# Altium schematic sheet Humi_Light_Pump.SchDoc
size A4
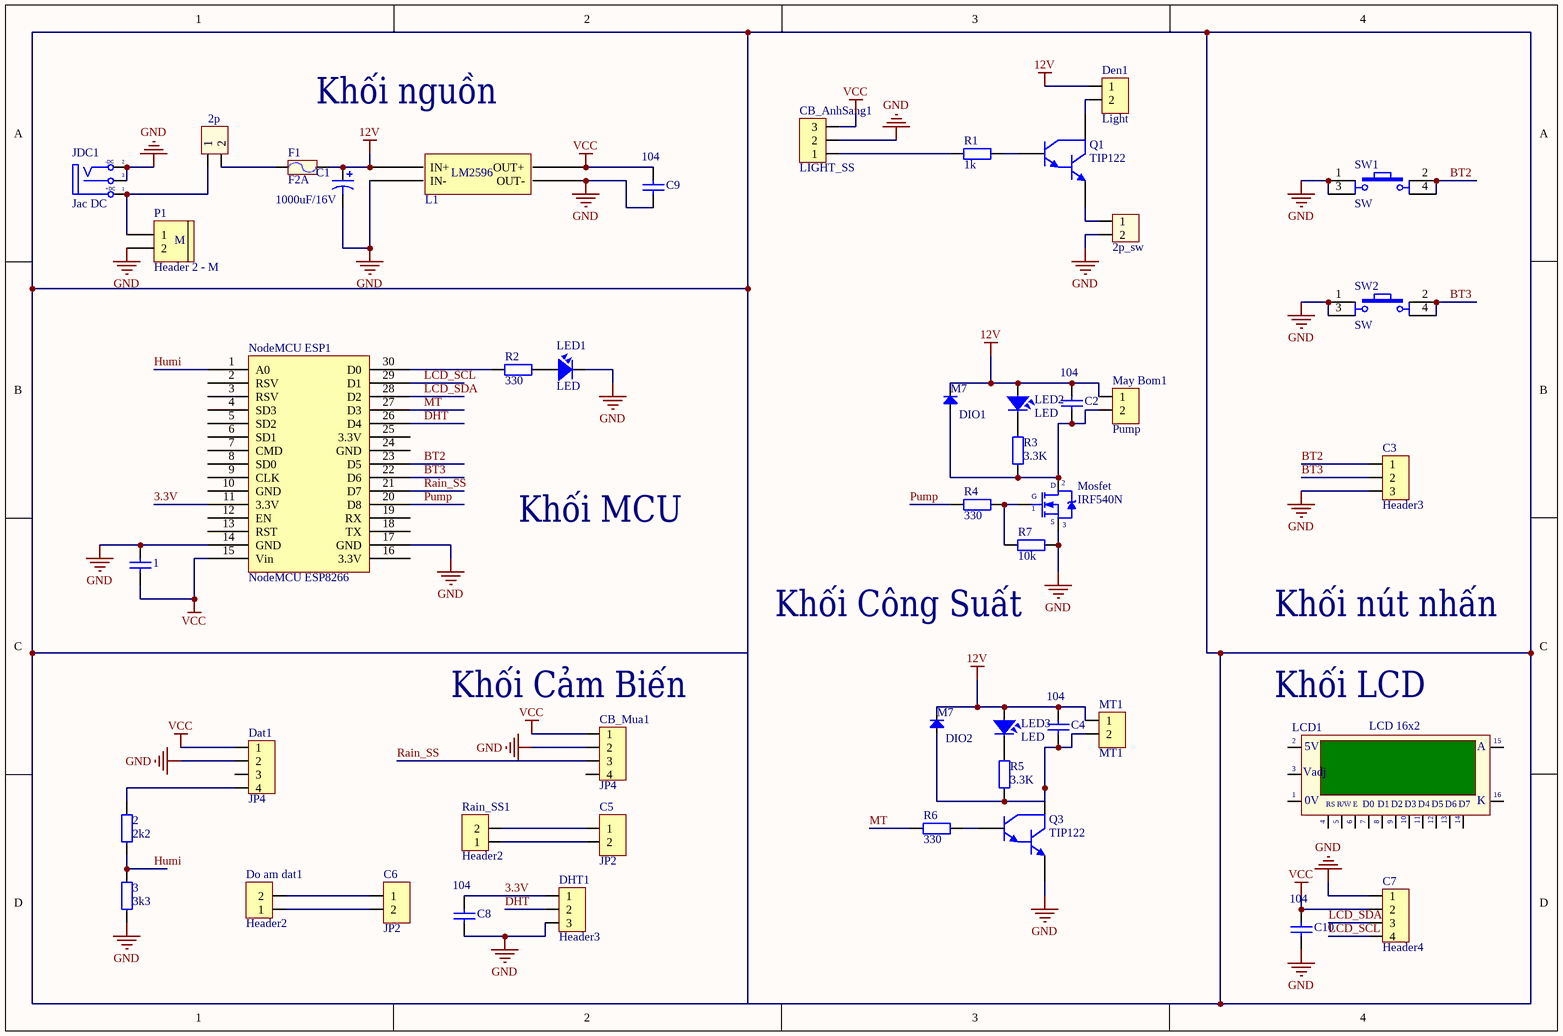
[diagram p0: Humi_Light_Pump.SchDoc]

## Parts
1  Capacitor Ceramic  [C1206]  (value not drawn)
2  2k2  [RES-SMD-1206]
3  3k3  [RES-SMD-1206]
C1  1000uF/16V  [C8mm]
C2  104  [C1206]
C3  Header3  [Header3]
C4  104  [C1206]
C5  JP2  [Header 2P DC 2.54]
C6  JP2  [Header 2P DC 2.54]
C7  Header4  [XH2.54M-4]
C8  104  [C1206]
C9  104  [C1206]
C10  104  [C1206]
CB_AnhSang1  LIGHT_SS  [Header 3P DC 2.54]
CB_Mua1  JP4  [JP4-C1T]
Dat1  JP4  [JP4-C1T]
Den1  Light  [Header 2P DC 2.54]
DHT1  Header3  [Header 3P DC 2.54]
DIO1  M7  [DIO-SMD-106]
DIO2  M7  [DIO-SMD-106]
Do_am_dat1  Header2  [Header2]
F1  F2A  [Fuse]
H1  2p  [XH2.54M-2]
H2  2p_sw  [XH2.54M-2]
JDC1  Jac DC  [DC-IN]
L1  BUCK_LM2596  [BUCK_LM2596]  (value not drawn)
LCD1  LCD 16x2  [LCD16X2N]
LED1  LED  [LED-5 GRe]
LED2  LED  [LED-5 GRe]
LED3  LED  [LED-5 GRe]
May_Bom1  Pump  [Header 2P DC 2.54]
Mosfet  IRF540N  [QTO-220]
MT1  MT1  [Header 2P DC 2.54]
NodeMCU_ESP1  NodeMCU ESP8266  [NodeMCU ESP8266]
P1  Header 2 - M  [Medium - Header 2]
Q1  TIP122  [QTO-220]
Q3  TIP122  [QTO-220]
R1  1k  [RES-SMD-1206]
R2  330  [RES-SMD-1206]
R3  3.3K  [RES-SMD-1206]
R4  330  [RES-SMD-1206]
R5  3.3K  [RES-SMD-1206]
R6  330  [RES-SMD-1206]
R7  10k  [RES-SMD-1206]
Rain_SS1  Header2  [Header2]
SW1  SW  [SW4]
SW2  SW  [SW4]

## Nets
12V: C1.1 C2.2 C4.2 Den1.1 DIO1.2(K) DIO2.2(K) F1.2 L1.1(IN+) LED2.1 LED3.1 May_Bom1.1 MT1.1
GND: 1.2 3.2 C1.2 C3.3 C7.1 C8.1 C9.1 C10.1 CB_AnhSang1.2 CB_Mua1.2 Dat1.2 DHT1.3 H2.2 JDC1.2(TN) JDC1.3(S) L1.2(IN-) L1.3(OUT-) LED1.2 Mosfet.3(S) NodeMCU_ESP1.14(GND) NodeMCU_ESP1.17(GND) P1.2 Q3.3(E) R7.1 SW1.1 SW1.3 SW2.1 SW2.3
VCC: 1.1 C7.2 C9.2 C10.2 CB_AnhSang1.3 CB_Mua1.1 Dat1.1 L1.4(OUT+) NodeMCU_ESP1.15(Vin)
3.3V: C8.2 DHT1.1 NodeMCU_ESP1.11(3.3V)
BT2: C3.1 NodeMCU_ESP1.23(D5) SW1.2 SW1.4
BT3: C3.2 NodeMCU_ESP1.22(D6) SW2.2 SW2.4
DHT: DHT1.2 NodeMCU_ESP1.26(D4)
Humi: 2.2 3.1 NodeMCU_ESP1.1(A0)
LCD_SCL: C7.4 NodeMCU_ESP1.29(D1)
LCD_SDA: C7.3 NodeMCU_ESP1.28(D2)
MT: NodeMCU_ESP1.27(D3) R6.2
Pump: NodeMCU_ESP1.20(D8) R4.2
Rain_SS: CB_Mua1.3 NodeMCU_ESP1.21(D7)
Net2_1: 2.1 Dat1.4
NetC2_1: C2.1 DIO1.1(A) May_Bom1.2 Mosfet.2(D) R3.2
NetC4_1: C4.1 DIO2.1(A) MT1.2 Q3.2(C) R5.2
NetC5_1: C5.1 Rain_SS1.2
NetC5_2: C5.2 Rain_SS1.1
NetC6_1: C6.1 Do_am_dat1.2
NetC6_2: C6.2 Do_am_dat1.1
NetCB_AnhSang1_1: CB_AnhSang1.1 R1.2
NetDen1_2: Den1.2 Q1.2(C)
NetF1_1: F1.1 H1.2
NetH1_1: H1.1 JDC1.1(T) P1.1
NetH2_1: H2.1 Q1.3(E)
NetLED1_1: LED1.1 R2.1
NetLED2_2: LED2.2 R3.1
NetLED3_2: LED3.2 R5.1
NetMosfet_1: Mosfet.1(G) R4.1 R7.2
NetNodeMCU_ESP1_30: NodeMCU_ESP1.30(D0) R2.2
NetQ1_1: Q1.1(B) R1.1
NetQ3_1: Q3.1(B) R6.1

Not connected (* = marked no-connect by the designer): CB_Mua1 4; Dat1 3; LCD1 1(GND) 2(VDD) 3(VAdj) 4(RS) 5(R/~{W}) 6(~{EN}) 7(D0) 8(D1) 9(D2) 10(D3) 11(D4) 12(D5) 13(D6) 14(D7) 15(A) 16(K); NodeMCU_ESP1 2(RSV) 3(RSV) 4(SD3) 5(SD2) 6(SD1) 7(CMD) 8(SD0) 9(CLK) 10(GND) 12(EN) 13(RST) 16(3.3V) 18(TX) 19(RX) 24(GND) 25(3.3V)

## Notes on the sheet
- Khối nguồn
- Khối MCU
- (near R7) Khối Công Suất
- Khối nút nhấn
- (near CB_Mua1) Khối Cảm Biến
- (near LCD1) Khối LCD
- (in symbol BUCK_LM2596) LM2596
- (in symbol DCIN) -DC; +DC
- (in symbol Header 2 - M) M
- (in symbol LCD) 5V; Vadj; |; 0V; R/W; E

## Library data of the parts
1 C2 C4 C8-C10 = CapSMD: Capacitor; Value: 33p; Published: 8-Jun-2000; LatestRevisionDate: 17-Jul-2002; LatestRevisionNote: Re-released for DXP Platform.; PackageReference: RAD-0.3; Publisher: Altium Limited
2 3 R1-R7 = R0805: Resistor SMD 0805; Published: 8-Jun-2000; LatestRevisionDate: 17-Jul-2002; LatestRevisionNote: Re-released for DXP Platform.; PackageReference: AXIAL-0.4; Publisher: Altium Limited
C1 = Cap Pol 12mm: Polarized Capacitor (Axial); Published: 8-Jun-2000; LatestRevisionDate: 17-Jul-2002; LatestRevisionNote: Re-released for DXP Platform.; PackageReference: POLAR0.8; Publisher: Altium Limited
C3 CB_AnhSang1 DHT1 = Header3: Header IDC, 3 x 1 Pin Vertical 2.54mm Pitch (Non-Boxed, Male); Manufacturer: W¨¹rth Elektronik eiSos GmbH; partNo: 613002143121; ComponentLink1 Description: Manufacturer; ComponentLink2 Description: Datasheet; NoPins: 02; Created Date: 29 March 2013; ComponentLink1URL: http://www.we-online.com; ComponentLink2URL: http://katalog.we-online.de/em/datasheet/6130xx143121.pdf; Created by: Karrer Zheng
C5 C6 = JP2: WR-PHD 2.54 mm Angled Socket Header; Manufacturer: W¨¹rth Elektronik eiSos GmbH; partNo: 613002143121; ComponentLink1 Description: Manufacturer; ComponentLink2 Description: Datasheet; NoPins: 02; Created Date: 29 March 2013; ComponentLink1URL: http://www.we-online.com; ComponentLink2URL: http://katalog.we-online.de/em/datasheet/6130xx143121.pdf; Created by: Karrer Zheng
C7 CB_Mua1 Dat1 = Header4: Header IDC, 4 x 1 Pin Vertical 2.54mm Pitch (Non-Boxed, Male); Manufacturer: W¨¹rth Elektronik eiSos GmbH; partNo: 613002143121; ComponentLink1 Description: Manufacturer; ComponentLink2 Description: Datasheet; NoPins: 02; Created Date: 29 March 2013; ComponentLink1URL: http://www.we-online.com; ComponentLink2URL: http://katalog.we-online.de/em/datasheet/6130xx143121.pdf; Created by: Karrer Zheng
Den1 Do_am_dat1 May_Bom1 MT1 Rain_SS1 = Header2: Header IDC, 2 x 1 Pin Vertical 2.54mm Pitch (Non-Boxed, Male); Manufacturer: W¨¹rth Elektronik eiSos GmbH; partNo: 613002143121; ComponentLink1 Description: Manufacturer; ComponentLink2 Description: Datasheet; NoPins: 02; Created Date: 29 March 2013; ComponentLink1URL: http://www.we-online.com; ComponentLink2URL: http://katalog.we-online.de/em/datasheet/6130xx143121.pdf; Created by: Karrer Zheng
DIO1 DIO2 = Diode SMD: Default Diode; Code - JEDEC: DO-214-AB; Value: 1N5007; Published: 8-Jun-2000; Revision: July-2002: Re-released for DXP Platform.; Publisher: Altium Limited
F1 = Fuse: Designed by: VanDungEvn; Value: Fuse
H1 H2 = Header 2P 2.54 Duc Thang: Cắm; Ten_Linh_Kien: Header 2P XH2.54-2P Đực Thẳng; Don_Vi: Con; Ma_Hang: MH001283; Chung_Loai: Cắm
JDC1 = DCIN: Jac DC input; Value: Jac DC
LCD1 = LCD
LED1-LED3 = LED: LED Single colour Green and Red; Value: LED 3 ly Single Colour
Mosfet = IRF840: MOSFET N - CHANNEL 500V - 0.75 - 8A - TO-220; Value: IRF840
P1 = Header 2 - M: Header, 2-Pin, Medium; LatestRevisionDate: 17-Jul-2002; LatestRevisionNote: Re-released for DXP Platform.; Publisher: Altium Limited
Q1 Q3 = TIP122: Darlington Silicon Power NPN Transistor, 8 Amp, 100 Volts and 65 Watts
SW1 SW2 = SW4: Switch button 4 pin; Value: Button chip 4 pin